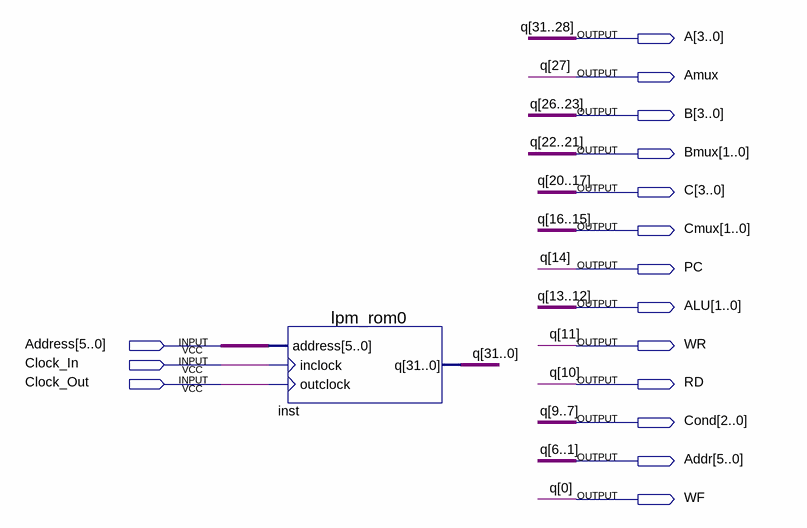
[diagram p0: schematic sheet]
// Quartus schematic rom.bdf as structural Verilog: 1 symbols, 16 pins
module rom (
  input  [5:0] Address,
  input  Clock_In,
  input  Clock_Out,
  output [3:0] A,
  output Amux,
  output [3:0] B,
  output [1:0] Bmux,
  output [3:0] C,
  output [1:0] Cmux,
  output PC,
  output [1:0] ALU,
  output WR,
  output RD,
  output [2:0] Cond,
  output [5:0] Addr,
  output WF
);

  lpm_rom0 inst (
    .address(Address), .inclock(Clock_In), .outclock(Clock_Out),
    .q({A, Amux, B, Bmux, C, Cmux, PC, ALU, WR, RD, Cond, Addr, WF}));

  // Other names for the same wires on the sheet: q[31:0] = {A, Amux, B, Bmux, C, Cmux, PC, ALU, WR, RD, Cond, Addr, WF}
endmodule
